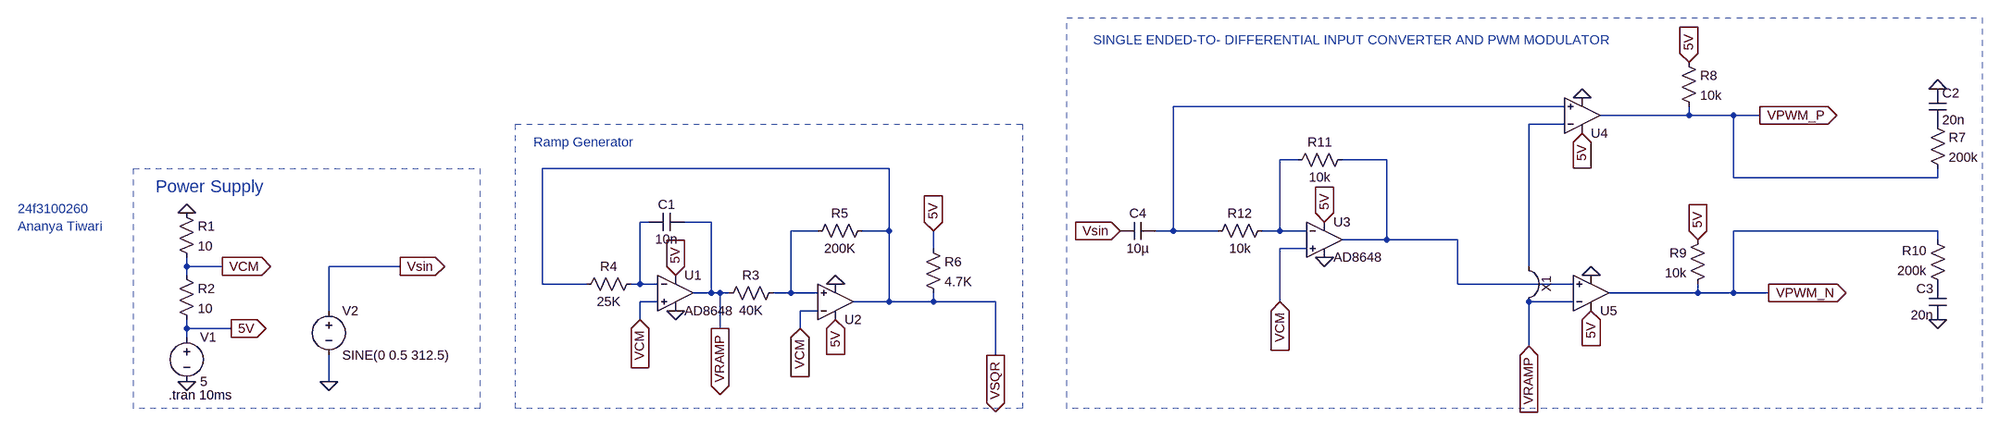
[diagram p0: schematic Analog 2.asc]
Analog 2.asc, the LTspice schematic file:
Version 4.1
SHEET 1 2612 680
WIRE 1856 -144 1152 -144
WIRE 2080 -128 2080 -144
WIRE 2080 -128 1920 -128
WIRE 2160 -128 2080 -128
WIRE 2208 -128 2160 -128
WIRE 1856 -112 1792 -112
WIRE 1376 -48 1344 -48
WIRE 1536 -48 1456 -48
WIRE 640 -32 16 -32
WIRE 2160 -16 2160 -128
WIRE 2528 -16 2528 -32
WIRE 2528 -16 2160 -16
WIRE 208 64 192 64
WIRE 320 64 272 64
WIRE 512 80 464 80
WIRE 640 80 640 -32
WIRE 640 80 592 80
WIRE 1152 80 1152 -144
WIRE 1152 80 1120 80
WIRE 1232 80 1152 80
WIRE 1344 80 1344 -48
WIRE 1344 80 1312 80
WIRE 1392 80 1344 80
WIRE 2528 80 2160 80
WIRE 1536 96 1536 -48
WIRE 1536 96 1456 96
WIRE 1664 96 1536 96
WIRE 2528 96 2528 80
WIRE 720 112 720 80
WIRE 1392 112 1344 112
WIRE -624 144 -624 128
WIRE -560 144 -624 144
WIRE -240 144 -368 144
WIRE 1792 144 1792 -112
WIRE -624 160 -624 144
WIRE 16 176 16 -32
WIRE 96 176 16 176
WIRE 192 176 192 64
WIRE 192 176 176 176
WIRE 224 176 192 176
WIRE 1664 176 1664 96
WIRE 1872 176 1664 176
WIRE 320 192 320 64
WIRE 320 192 288 192
WIRE 336 192 320 192
WIRE 352 192 336 192
WIRE 464 192 464 80
WIRE 464 192 432 192
WIRE 512 192 464 192
WIRE 2096 192 2096 176
WIRE 2096 192 1936 192
WIRE 2160 192 2160 80
WIRE 2160 192 2096 192
WIRE 2224 192 2160 192
WIRE 224 208 192 208
WIRE 640 208 640 80
WIRE 640 208 576 208
WIRE 720 208 720 192
WIRE 720 208 640 208
WIRE 832 208 720 208
WIRE 1344 208 1344 112
WIRE 1872 208 1792 208
WIRE -368 224 -368 144
WIRE 512 224 480 224
WIRE 192 240 192 208
WIRE -624 256 -624 240
WIRE -544 256 -624 256
WIRE 336 256 336 192
WIRE 480 256 480 224
WIRE -624 272 -624 256
WIRE 1792 288 1792 208
WIRE 832 304 832 208
WIRE -368 352 -368 304
FLAG -624 352 0
FLAG -624 48 0
FLAG -560 144 VCM
IOPIN -560 144 Out
FLAG -544 256 5V
IOPIN -544 256 Out
FLAG -368 352 0
FLAG -240 144 Vsin
IOPIN -240 144 Out
FLAG 192 240 VCM
IOPIN 192 240 In
FLAG 720 80 5V
IOPIN 720 80 In
FLAG 832 304 VSQR
IOPIN 832 304 Out
FLAG 336 256 VRAMP
IOPIN 336 256 Out
FLAG 256 224 0
FLAG 256 160 5V
IOPIN 256 160 In
FLAG 480 256 VCM
IOPIN 480 256 In
FLAG 544 240 5V
IOPIN 544 240 In
FLAG 544 176 0
FLAG 1888 -160 0
FLAG 1904 160 0
FLAG 1424 128 0
FLAG 2528 -176 0
FLAG 2080 -224 5V
IOPIN 2080 -224 In
FLAG 2096 96 5V
IOPIN 2096 96 In
FLAG 2528 240 0
FLAG 2208 -128 VPWM_P
IOPIN 2208 -128 Out
FLAG 2224 192 VPWM_N
IOPIN 2224 192 Out
FLAG 1904 224 5V
IOPIN 1904 224 In
FLAG 1888 -96 5V
IOPIN 1888 -96 In
FLAG 1424 64 5V
IOPIN 1424 64 In
FLAG 1056 80 Vsin
IOPIN 1056 80 In
FLAG 1792 288 VRAMP
IOPIN 1792 288 In
FLAG 1344 208 VCM
IOPIN 1344 208 In
SYMBOL res -640 32 R0
SYMATTR InstName R1
SYMATTR Value 10
SYMATTR SpiceLine tol=1 pwr=0.1
SYMBOL res -640 144 R0
SYMATTR InstName R2
SYMATTR Value 10
SYMBOL voltage -624 256 R0
WINDOW 123 0 0 Left 0
WINDOW 39 0 0 Left 0
SYMATTR InstName V1
SYMATTR Value 5
SYMBOL voltage -368 208 R0
WINDOW 123 0 0 Left 0
WINDOW 39 0 0 Left 0
SYMATTR InstName V2
SYMATTR Value SINE(0 0.5 312.5)
SYMBOL OpAmps\\AD8648 256 128 R0
SYMATTR InstName U1
SYMBOL OpAmps\\UniversalOpAmp2 544 208 M180
SYMATTR InstName U2
SYMBOL res 448 176 R90
WINDOW 0 0 56 VBottom 2
WINDOW 3 32 56 VTop 2
SYMATTR InstName R3
SYMATTR Value 40K
SYMATTR SpiceLine tol=1 pwr=0
SYMBOL res 192 160 R90
WINDOW 0 0 56 VBottom 2
WINDOW 3 32 56 VTop 2
SYMATTR InstName R4
SYMATTR Value 25K
SYMBOL res 608 64 R90
WINDOW 0 0 56 VBottom 2
WINDOW 3 32 56 VTop 2
SYMATTR InstName R5
SYMATTR Value 200K
SYMBOL cap 272 48 R90
WINDOW 0 0 32 VBottom 2
WINDOW 3 32 32 VTop 2
SYMATTR InstName C1
SYMATTR Value 10n
SYMBOL res 704 96 R0
SYMATTR InstName R6
SYMATTR Value 4.7K
SYMBOL OpAmps\\AD8648 1424 32 R0
SYMATTR InstName U3
SYMBOL OpAmps\\UniversalOpAmp2 1888 -128 M180
SYMATTR InstName U4
SYMBOL OpAmps\\UniversalOpAmp2 1904 192 M180
SYMATTR InstName U5
SYMBOL res 2512 -128 R0
SYMATTR InstName R7
SYMATTR Value 200k
SYMBOL cap 2512 -176 R0
SYMATTR InstName C2
SYMATTR Value 20n
SYMBOL res 2064 -240 R0
SYMATTR InstName R8
SYMATTR Value 10k
SYMBOL res 2112 80 M0
SYMATTR InstName R9
SYMATTR Value 10k
SYMBOL res 2544 192 R180
WINDOW 0 36 76 Left 2
WINDOW 3 36 40 Left 2
SYMATTR InstName R10
SYMATTR Value 200k
SYMBOL cap 2544 240 R180
WINDOW 0 24 56 Left 2
WINDOW 3 24 8 Left 2
SYMATTR InstName C3
SYMATTR Value 20n
SYMBOL res 1472 -64 R90
WINDOW 0 0 56 VBottom 2
WINDOW 3 32 56 VTop 2
SYMATTR InstName R11
SYMATTR Value 10k
SYMBOL res 1328 64 R90
WINDOW 0 0 56 VBottom 2
WINDOW 3 32 56 VTop 2
SYMATTR InstName R12
SYMATTR Value 10k
SYMBOL cap 1120 64 R90
WINDOW 0 0 32 VBottom 2
WINDOW 3 32 32 VTop 2
SYMATTR InstName C4
SYMATTR Value 10µ
SYMBOL Misc\\jumper 1856 176 R90
SYMATTR InstName X1
TEXT -656 376 Left 2 !.tran 10ms
TEXT -680 0 Left 3 ;Power Supply
TEXT 0 -80 Left 2 ;Ramp Generator
TEXT 1008 -264 Left 2 ;SINGLE ENDED-TO- DIFFERENTIAL INPUT CONVERTER AND PWM MODULATOR
TEXT -928 40 Left 2 ;24f3100260
TEXT -928 72 Left 2 ;Ananya Tiwari
RECTANGLE Normal -96 400 -720 -32 2
RECTANGLE Normal 880 400 -32 -112 2
RECTANGLE Normal 2608 400 960 -304 2

The netlist it stands for:
* Analog 2.asc
R1 0 VCM 10 tol=1 pwr=0.1
R2 VCM 5V 10
V1 5V 0 5
V2 Vsin 0 SINE(0 0.5 312.5)
X§U1 VCM N004 5V 0 VRAMP AD8648  ; pins In+ In- V+ V- OUT
X§U2 N005 VCM 5V 0 VSQR level2 Avol=1Meg GBW=10Meg Slew=10Meg Ilimit=25m Rail=0 Vos=0 En=0 Enk=0 In=0 Ink=0 Rin=500Meg  ; pins In+ In- V+ V- OUT
R3 N005 VRAMP 40K tol=1 pwr=0
R4 N004 VSQR 25K
R5 VSQR N005 200K
C1 VRAMP N004 10n
R6 5V VSQR 4.7K
X§U3 VCM N002 5V 0 N003 AD8648  ; pins In+ In- V+ V- OUT
X§U4 N001 VRAMP 5V 0 VPWM_P level2 Avol=1Meg GBW=10Meg Slew=10Meg Ilimit=25m Rail=0 Vos=0 En=0 Enk=0 In=0 Ink=0 Rin=500Meg  ; pins In+ In- V+ V- OUT
X§U5 N003 VRAMP 5V 0 VPWM_N level2 Avol=1Meg GBW=10Meg Slew=10Meg Ilimit=25m Rail=0 Vos=0 En=0 Enk=0 In=0 Ink=0 Rin=500Meg  ; pins In+ In- V+ V- OUT
R7 P001 VPWM_P 200k
C2 0 P001 20n
R8 5V VPWM_P 10k
R9 5V VPWM_N 10k
R10 P002 VPWM_N 200k
C3 0 P002 20n
R11 N003 N002 10k
R12 N002 N001 10k
C4 N001 Vsin 10µ
.tran 10ms
* Power Supply
* Ramp Generator
* SINGLE ENDED-TO- DIFFERENTIAL INPUT CONVERTER AND PWM MODULATOR
* 24f3100260
* Ananya Tiwari
.lib ADI.lib
.lib UniversalOpAmp2.lib
.backanno
.end